# EAGLE design gh (EAGLE 9.0.1)
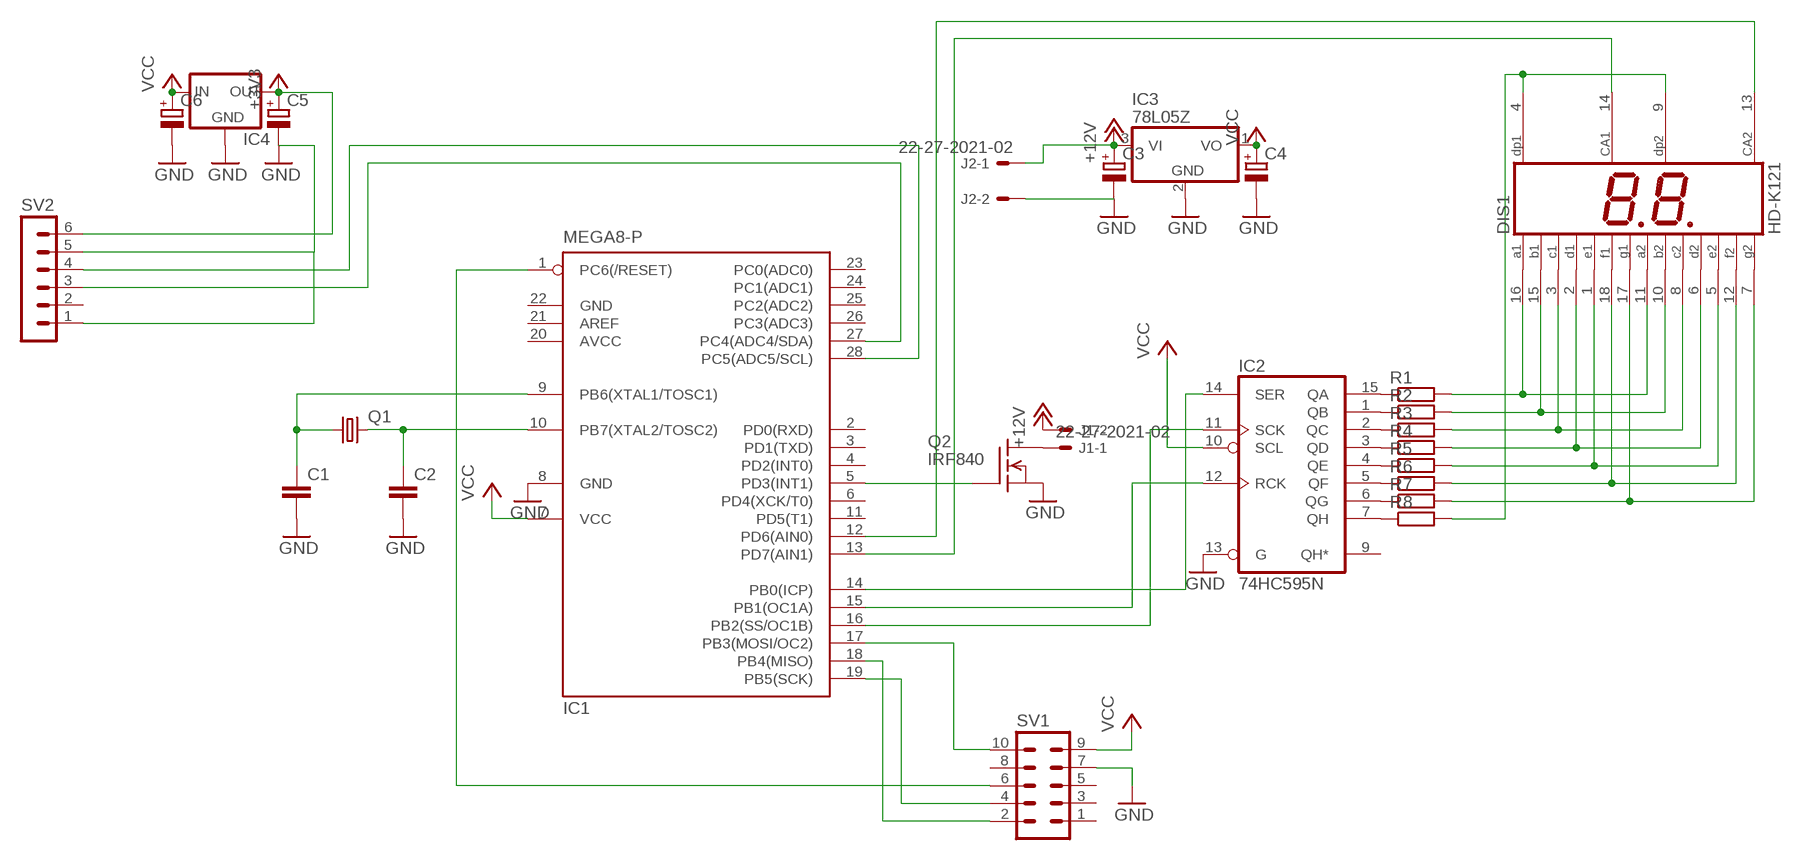
[diagram p0: schematic, sheet 1]

## Parts
C1  C-EU025-024X044  [C025-024X044]
C2  C-EU025-024X044  [C025-024X044]
C3  CPOL-EUE2,5-6E  [E2,5-6E]
C4  CPOL-EUE2,5-6E  [E2,5-6E]
C5  CPOL-EUE2,5-6E  [E2,5-6E]
C6  CPOL-EUE2,5-6E  [E2,5-6E]
DIS1  HD-K121  [HDSP-R]
IC1  MEGA8-P  [DIL28-3]
IC2  74HC595N  [DIL16]
IC3  78L05Z  [TO92]
IC4  78LXX  [78LXX]
J1  22-27-2021-02  [6410-02]
J2  22-27-2021-02  [6410-02]
Q1  CRYSTALHC49U70  [HC49U70]
Q2  IRF840  [TO220]
R1  R-EU_0204/2V  [0204V]
R2  R-EU_0204/2V  [0204V]
R3  R-EU_0204/2V  [0204V]
R4  R-EU_0204/2V  [0204V]
R5  R-EU_0204/2V  [0204V]
R6  R-EU_0204/2V  [0204V]
R7  R-EU_0204/2V  [0204V]
R8  R-EU_0204/2V  [0204V]
SV1  MA05-2  [MA05-2]
SV2  MA06-1  [MA06-1]

## Nets
+3V3: C5.+ IC4.OUT SV2.6
+12V: C3.+ IC3.3(VI) J1.2 J2.1
GND: C1.2 C2.2 C3.- C4.- C5.- C6.- IC1.8(GND) IC2.13(G) IC3.2(GND) IC4.GND J2.2 Q2.3(S) SV1.7 SV2.1 SV2.5
N$1: IC1.14(PB0(ICP)) IC2.14(SER)
N$3: J1.1 Q2.2(D)
N$4: IC1.17(PB3(MOSI/OC2)) SV1.10
N$5: IC1.18(PB4(MISO)) SV1.2
N$6: IC1.1(PC6(/RESET)) SV1.6
N$7: IC1.19(PB5(SCK)) SV1.4
N$8: C2.1 IC1.10(PB7(XTAL2/TOSC2)) Q1.2
N$9: C1.1 IC1.9(PB6(XTAL1/TOSC1)) Q1.1
N$10: DIS1.11(A2) DIS1.16(A1) R1.2
N$11: DIS1.10(B2) DIS1.15(B1) R2.2
N$12: DIS1.3(C1) DIS1.8(C2) R3.2
N$13: DIS1.2(D1) DIS1.6(D2) R4.2
N$14: DIS1.1(E1) DIS1.5(E2) R5.2
N$15: DIS1.12(F2) DIS1.18(F1) R6.2
N$16: DIS1.7(G2) DIS1.17(G1) R7.2
N$17: IC2.15(QA) R1.1
N$18: IC2.1(QB) R2.1
N$19: IC2.2(QC) R3.1
N$20: IC2.3(QD) R4.1
N$21: IC2.4(QE) R5.1
N$22: IC2.5(QF) R6.1
N$23: IC2.6(QG) R7.1
N$24: IC2.7(QH) R8.1
N$25: IC1.5(PD3(INT1)) Q2.1(G)
N$26: DIS1.4(DP1) DIS1.9(DP2) R8.2
N$27: DIS1.14(CA1) IC1.13(PD7(AIN1))
N$28: DIS1.13(CA2) IC1.12(PD6(AIN0))
N$30: IC1.28(PC5(ADC5/SCL)) SV2.4
N$31: IC1.27(PC4(ADC4/SDA)) SV2.3
N$32: IC1.15(PB1(OC1A)) IC2.12(RCK)
N$33: IC1.16(PB2(SS/OC1B)) IC2.11(SCK)
VCC: C4.+ C6.+ IC1.7(VCC) IC2.10(SCL) IC3.1(VO) IC4.IN SV1.9
Unconnected: IC1.2(PD0(RXD)) IC1.3(PD1(TXD)) IC1.4(PD2(INT0)) IC1.6(PD4(XCK/T0)) IC1.11(PD5(T1)) IC1.21(AREF) IC1.23(PC0(ADC0)) IC1.24(PC1(ADC1)) IC1.25(PC2(ADC2)) IC1.26(PC3(ADC3)) IC2.9(QH*) SV1.1 SV1.3 SV1.5 SV1.8 SV2.2

## Power pins joined to a net without a drawn wire
AVCC: IC1.20(AVCC)
GND: IC1.22(GND) IC2.8(GND)
VCC: IC2.16(VCC)

## Library data of the parts
C1 C2 = resistor:C-EU: CAPACITOR, European symbol
C3-C6 = resistor:CPOL-EU: POLARIZED CAPACITOR, European symbol
DIS1 = display-hp:HD-K121: LED DISPLAY 2 x 1 character 7 segment, decimal points right; OC_FARNELL: unknown; OC_NEWARK: unknown
IC1 = atmel:MEGA8-P: MICROCONTROLLER 8 Kbytes FLASH, 1 kbytes SRAM, 512 bytes EEPROM, USART, 4-channel 10 bit ADC, 2-channel 8 bit ADC Pin compatible with Atmega48, ATMega88, ATMega168 Source: avr.lbr; OC_FARNELL: unknown; OC_NEWARK: unknown
IC2 = 74xx-eu:74*595: 8-bit SHIFT REGISTER, output latch
IC3 = linear:78*: Positive VOLTAGE REGULATOR Source: http://cache.national.com/ds/LM/LM78L05.pdf http://www.fairchildsemi.com/ds/LM/LM7805.pdf
IC4 = v-reg:78LXX: VOLTAGE REGULATOR
J1 J2 = con-molex:22-?-02: CONNECTOR wire to board 2.54 mm (.1 inch) pitch header; MF: MOLEX; OC_FARNELL: unknown; OC_NEWARK: unknown
Q1 = crystal:CRYSTAL: CRYSTAL; OC_FARNELL: unknown; OC_NEWARK: unknown
Q2 = transistor-fet:IRF840: N-Channel Enhancement MOSFET (HEXFET); 500V; 8A; 0,85Ohm
R1-R8 = resistor:R-EU_: RESISTOR, European symbol
SV1 = con-lstb:MA05-2: PIN HEADER; OC_FARNELL: unknown; OC_NEWARK: unknown
SV2 = con-lstb:MA06-1: PIN HEADER; OC_FARNELL: unknown; OC_NEWARK: unknown

## Board
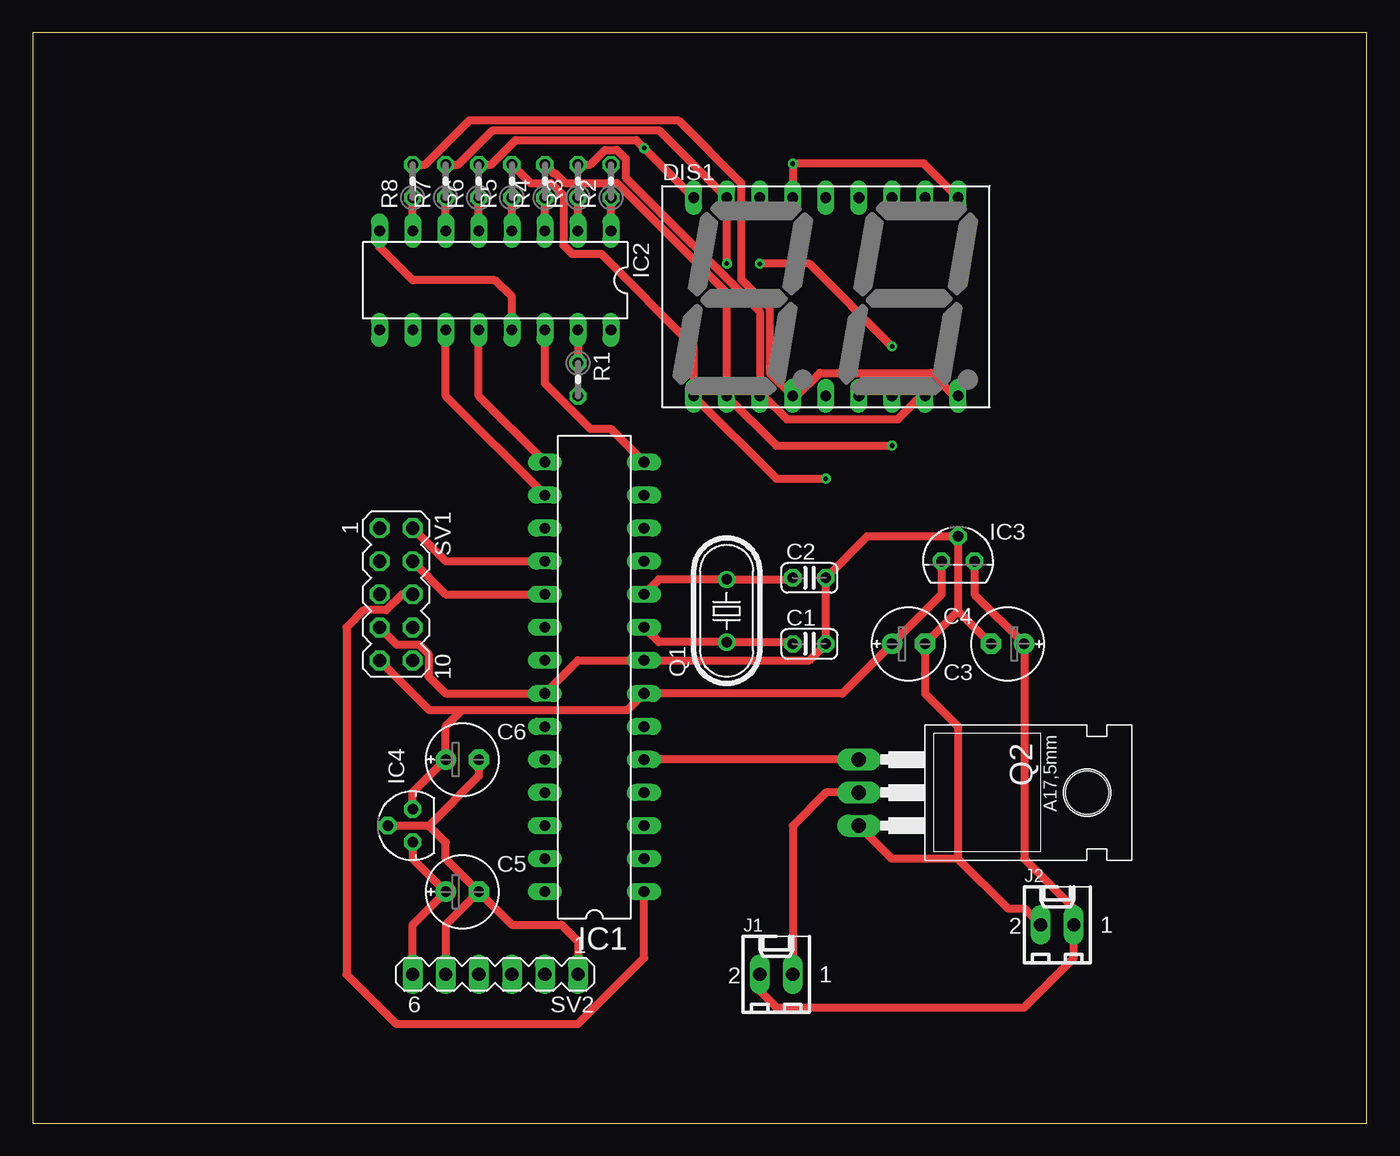
[diagram p1: board, top side]
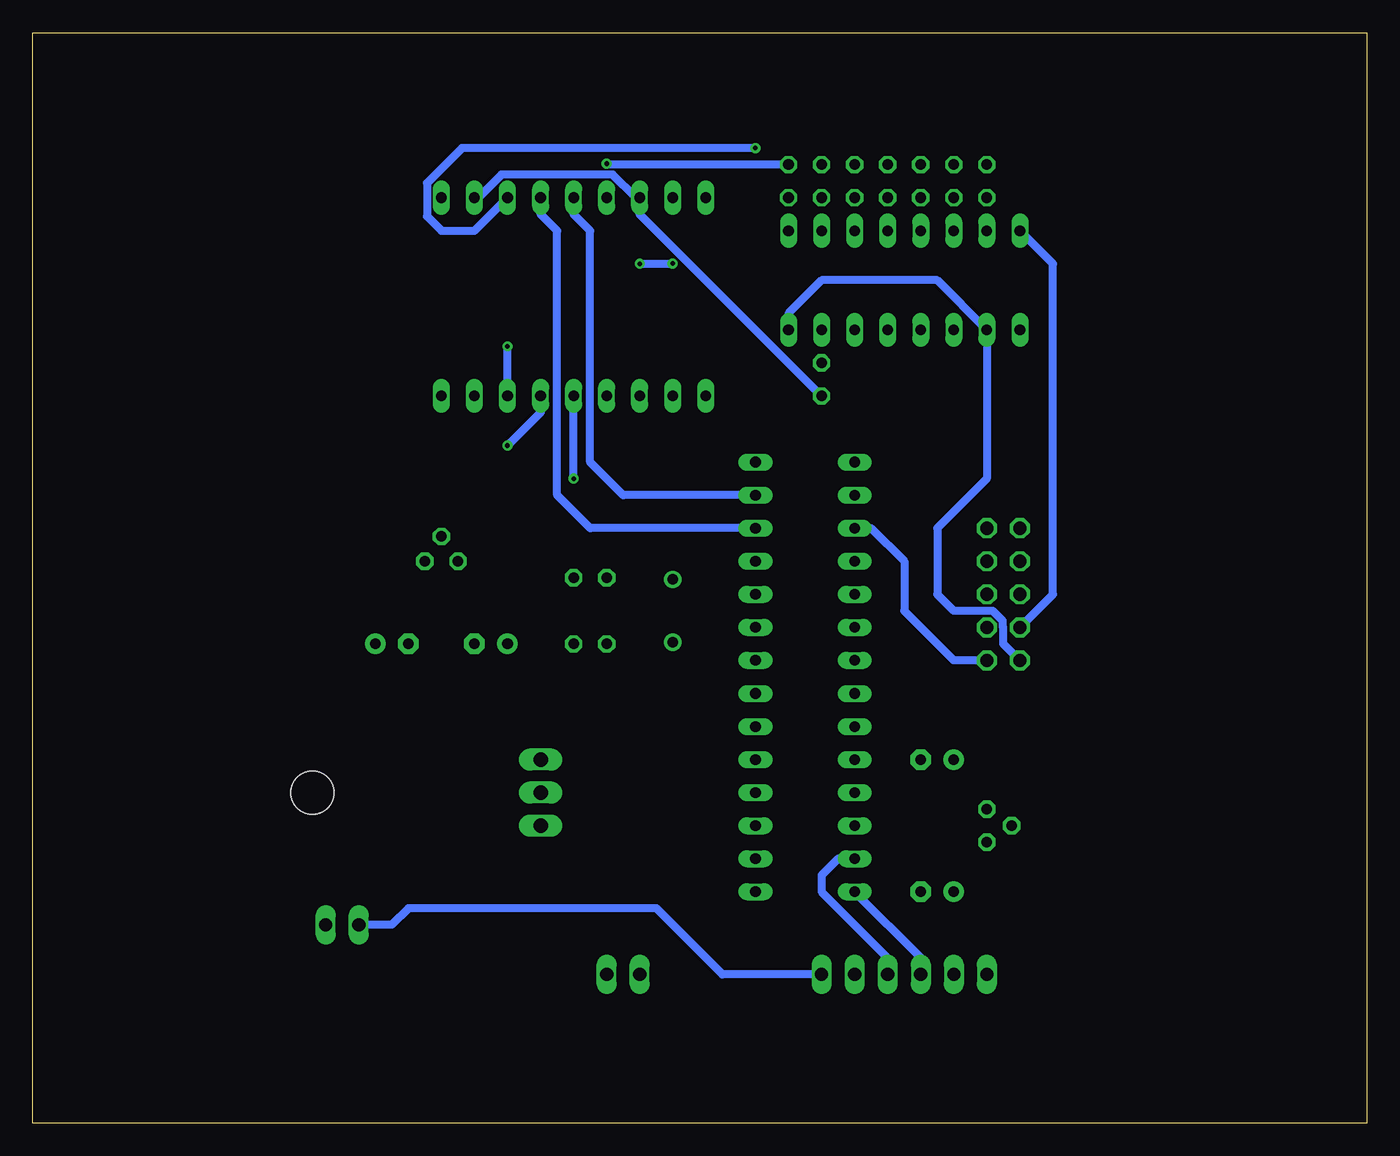
[diagram p2: board, bottom side, seen from below]

Size 102.54 x 83.81 mm. Coordinates in mm from the lower left corner, seen from the top.
Outline: 0,0 102.54,0 102.54,83.81 0,83.81 0,0
Copper layers (1*16): Top 0.035mm / dielectric 1.5mm / Bottom 0.035mm
Design rules "default": minimum track width 6mil, minimum drill 0.35mm, track to track 6mil, track to pad 6mil, pad to pad 6mil, via to via 6mil, smd to smd 6mil, copper to edge 40mil, drill to drill 6mil, minimum pad ring 10mil, minimum via ring 8mil, stop-mask expansion 4mil, vias tented up to drill 0mil, thermal gap 10mil

### Footprints (pad centres in the part's own frame; a part is rotated, then mirrored left to right if it is on the bottom)
C025-024X044 = drill 0.813 octagon: 1 -1.27,0; 2 1.27,0
E2,5-6E = drill 0.813 pad 1.575: + -1.27,0 | drill 0.813 pad 1.575 octagon: - 1.27,0
HDSP-R = drill 0.813 long: 1 -10.16,-7.62; 2 -7.62,-7.62; 3 -5.08,-7.62; 4 -2.54,-7.62; 5 0,-7.62; 6 2.54,-7.62; 7 5.08,-7.62; 8 7.62,-7.62; 9 10.16,-7.62; 10 10.16,7.62; 11 7.62,7.62; 12 5.08,7.62; 13 2.54,7.62; 14 0,7.62; 15 -2.54,7.62; 16 -5.08,7.62; 17 -7.62,7.62; 18 -10.16,7.62
DIL28-3 = drill 0.813 long: 1 -16.51,-3.81; 2 -13.97,-3.81; 3 -11.43,-3.81; 4 -8.89,-3.81; 5 -6.35,-3.81; 6 -3.81,-3.81; 7 -1.27,-3.81; 8 1.27,-3.81; 9 3.81,-3.81; 10 6.35,-3.81; 11 8.89,-3.81; 12 11.43,-3.81; 13 13.97,-3.81; 14 16.51,-3.81; 15 16.51,3.81; 16 13.97,3.81; 17 11.43,3.81; 18 8.89,3.81; 19 6.35,3.81; 20 3.81,3.81; 21 1.27,3.81; 22 -1.27,3.81; 23 -3.81,3.81; 24 -6.35,3.81; 25 -8.89,3.81; 26 -11.43,3.81; 27 -13.97,3.81; 28 -16.51,3.81
DIL16 = drill 0.813 long: 1 -8.89,-3.81; 2 -6.35,-3.81; 3 -3.81,-3.81; 4 -1.27,-3.81; 5 1.27,-3.81; 6 3.81,-3.81; 7 6.35,-3.81; 8 8.89,-3.81; 9 8.89,3.81; 10 6.35,3.81; 11 3.81,3.81; 12 1.27,3.81; 13 -1.27,3.81; 14 -3.81,3.81; 15 -6.35,3.81; 16 -8.89,3.81
TO92 = drill 0.813 octagon: 1 -1.27,0; 2 0,1.905; 3 1.27,0
78LXX = drill 0.813 octagon: GND 0,1.905; IN 1.27,0; OUT -1.27,0
6410-02 = drill 1.016 long: 1 1.27,0; 2 -1.27,0
HC49U70 = drill 0.813: 1 -2.413,0; 2 2.413,0
TO220 = drill 1.118 long: 1 -2.54,-6.35; 2 0,-6.35; 3 2.54,-6.35 | hole 3.302: 0,11.176
0204V = drill 0.813 octagon: 1 -1.27,0; 2 1.27,0
MA05-2 = drill 1.016 octagon: 1 -5.08,-1.27; 2 -5.08,1.27; 3 -2.54,-1.27; 4 -2.54,1.27; 5 0,-1.27; 6 0,1.27; 7 2.54,-1.27; 8 2.54,1.27; 9 5.08,-1.27; 10 5.08,1.27
MA06-1 = drill 1.016 long: 1 -6.35,0; 2 -3.81,0; 3 -1.27,0; 4 1.27,0; 5 3.81,0; 6 6.35,0

### Placement (x,y rotation side)
C1  59.69,36.83 0 top
C2  59.69,41.91 0 top
C3  74.93,36.83 180 top
C4  67.31,36.83 0 top
C5  33.02,17.78 0 top
C6  33.02,27.94 0 top
DIS1  60.96,63.5 0 top
IC1  43.18,34.29 90 top
IC2  35.56,64.77 180 top
IC3  71.12,43.18 0 top
IC4  29.21,22.86 90 top
J1  57.15,11.43 0 top
J2  78.74,15.24 0 top
Q1  53.34,39.37 90 top
Q2  69.85,25.4 270 top
R1  41.91,57.15 270 top
R2  44.45,72.39 90 top
R3  41.91,72.39 90 top
R4  39.37,72.39 90 top
R5  36.83,72.39 90 top
R6  34.29,72.39 90 top
R7  31.75,72.39 90 top
R8  29.21,72.39 90 top
SV1  27.94,40.64 270 top
SV2  35.56,11.43 180 top

### Tracks (layer width: path | path; a pad name or v marks a point on that pad's centre or on a via)
+3V3
  Top 0.61: SV2.6 29.21,15.24 C5.+ 29.21,20.32 IC4.OUT
+12V
  Top 0.61: IC3.3 72.39,40.64 C3.+ 76.2,20.32 80.01,16.51 J2.1 80.01,12.7 76.2,8.89 57.15,8.89 55.88,10.16 J1.2
GND
  Top 0.61: C5.- 31.75,15.24 SV2.5 | C5.- 36.83,15.24 40.64,15.24 41.91,13.97 SV2.1 | C5.- 31.75,20.32 31.75,21.59 30.48,22.86 | 30.48,22.86 IC4.GND | C6.- 34.29,26.67 30.48,22.86 | SV1.7 27.99,36.78 29.71,36.78 30.43,36.06 30.43,34.34 31.75,33.02 IC1.22 41.91,35.56 IC1.8 59.69,35.56 C1.2 C2.2 64.14,45.09 IC3.2 71.12,39.37 | 71.12,39.37 C4.- 68.58,33.02 71.12,30.48 71.12,20.32 | 71.12,39.37 C3.- | J2.2 76.2,16.51 74.93,16.51 71.12,20.32 | 71.12,20.32 66.04,20.32 Q2.3 | IC2.13 36.83,63.5 35.56,64.77 29.21,64.77 26.67,67.31 IC2.8
  Bottom 0.61: SV2.1 49.53,11.43 54.61,16.51 73.66,16.51 74.93,15.24 J2.2 | SV1.7 24.13,40.64 24.13,66.04 IC2.8
N$1
  Top 0.61: IC1.14 44.45,53.34 42.87,53.34 39.37,56.84 IC2.14
N$3
  Top 0.61: Q2.2 60.96,25.4 58.42,22.86 J1.1
N$4
  Bottom 0.61: SV1.10 31.75,35.56 35.56,39.37 35.56,43.18 38.1,45.72 IC1.17
N$5
  Top 0.61: SV1.2 31.75,43.18 IC1.18
N$6
  Top 0.61: SV1.6 28.39,40.64 27.18,39.42 25.45,39.42 24.13,38.1 24.13,11.43 27.94,7.62 41.91,7.62 46.99,12.7 IC1.1
N$7
  Top 0.61: SV1.4 31.75,40.64 IC1.19
N$8
  Top 0.61: IC1.10 48.13,41.78 Q1.2 58.29,41.78 C2.1
N$9
  Top 0.61: IC1.9 48.13,36.96 Q1.1 58.29,36.96 C1.1
N$10
  Top 0.61: 55.88,69.85 DIS1.16
  Bottom 0.61: R1.2 55.88,69.85 DIS1.16 56.18,71.12 57.96,72.9 66.5,72.9 68.28,71.12 DIS1.11
N$11  (via drill 0.35)
  Top 0.61: DIS1.15 v58.42,73.73 68.51,73.73 DIS1.10
  Bottom 0.61: R2.2 58.42,73.66 v58.42,73.73
N$12
  Top 0.61: R3.2 42.87,73.66 43.99,74.78 44.91,74.78 45.57,74.12 45.57,72.66 55.88,62.35 DIS1.3 56.18,55.88 57.96,54.1 66.5,54.1 68.28,55.88 DIS1.8
N$13  (via drill 0.35)
  Top 0.61: R4.2 40.03,73 40.15,73 40.91,72.24 44.91,72.24 53.34,63.81 DIS1.2 57.15,52.07 v66.04,52.07
  Bottom 0.61: v66.04,52.07 63.5,54.61 DIS1.6
N$14  (via drill 0.35)
  Top 0.61: R5.2 38.25,72.24 39.83,72.24 40.79,71.28 40.79,67.46 41.45,66.8 43.69,66.8 50.8,59.69 DIS1.1 57.15,49.53 v60.96,49.53
  Bottom 0.61: v60.96,49.53 DIS1.5
N$15  (via drill 0.35)
  Top 0.61: R6.2 35.25,73.66 37.13,75.54 46.38,75.54 v46.99,74.93 DIS1.18
  Bottom 0.61: v46.99,74.93 69.55,74.93 72.24,72.24 72.24,69.7 71.12,68.58 68.58,68.58 DIS1.12
N$16  (via drill 0.35)
  Top 0.61: R7.2 32.71,73.66 35.35,76.3 48.16,76.3 DIS1.17 53.35,71.11 v53.35,66.06 | v66.04,59.69 59.69,66.04 v55.88,66.04
  Bottom 0.61: DIS1.7 v66.04,59.69 | v55.88,66.04 v53.34,66.04 v53.35,66.06
N$17
  Top 0.61: IC2.15 R1.1
N$18
  Top 0.61: IC2.1 R2.1
N$19
  Top 0.61: IC2.2 R3.1
N$20
  Top 0.61: IC2.3 R4.1
N$21
  Top 0.61: IC2.4 R5.1
N$22
  Top 0.61: IC2.5 R6.1
N$23
  Top 0.61: IC2.6 R7.1
N$24
  Top 0.61: IC2.7 R8.1
N$25
  Top 0.61: Q2.1 IC1.5
N$26
  Top 0.61: R8.2 30.17,73.66 33.57,77.06 49.64,77.06 54.46,72.24 54.46,64.85 56.64,62.66 56.64,57.66 DIS1.4 58.72,55.88 60.5,57.66 69.04,57.66 70.82,55.88 DIS1.9
N$27
  Bottom 0.61: IC1.13 57.15,48.26 59.69,50.8 59.69,68.58 60.96,69.85 DIS1.14
N$28
  Bottom 0.61: IC1.12 59.69,45.72 62.23,48.26 62.23,68.58 63.5,69.85 DIS1.13
N$30
  Bottom 0.61: IC1.28 34.29,12.7 SV2.4
N$31
  Bottom 0.61: IC1.27 40.64,20.32 41.91,19.05 41.91,17.78 36.83,12.7 SV2.3
N$32
  Top 0.61: IC1.15 34.29,55.88 IC2.12
N$33
  Top 0.61: IC1.16 31.75,55.88 IC2.11
VCC
  Top 0.61: IC3.1 69.85,40.64 C4.+ 62.23,33.02 IC1.7 45.72,31.75 33.02,31.75 | SV1.9 30.48,31.75 33.02,31.75 | IC4.IN 29.21,25.4 C6.+ 31.75,30.48 33.02,31.75
  Bottom 0.61: IC2.16 44.45,62.23 41.91,64.77 33.02,64.77 IC2.10 29.21,49.53 33.02,45.72 33.02,40.64 31.75,39.37 28.76,39.37 27.99,38.6 27.99,38.15 27.94,38.1 27.94,36.83 SV1.9